# Altium schematic sheet 00_BLBB_Top.SchDoc
size A4; SheetNumber: 1; SheetTotal: 4
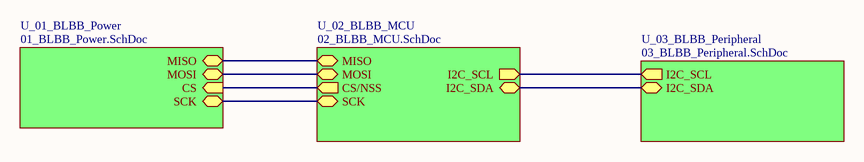
[diagram p0: 00_BLBB_Top.SchDoc]

## Sub-sheets
U_01_BLBB_Power = 01_BLBB_Power.SchDoc: MISO (bidir), SCK (bidir), CS (in), MOSI (bidir)
U_02_BLBB_MCU = 02_BLBB_MCU.SchDoc: I2C_SDA (bidir), MISO (bidir), MOSI (bidir), CS/NSS (out), SCK (bidir), I2C_SCL (out)
U_03_BLBB_Peripheral = 03_BLBB_Peripheral.SchDoc: I2C_SCL (out), I2C_SDA (bidir)

## Nets
(unnamed): sheet U_01_BLBB_Power/MISO, sheet U_02_BLBB_MCU/MISO
(unnamed): sheet U_01_BLBB_Power/SCK, sheet U_02_BLBB_MCU/SCK
(unnamed): sheet U_01_BLBB_Power/CS, sheet U_02_BLBB_MCU/CS/NSS
(unnamed): sheet U_01_BLBB_Power/MOSI, sheet U_02_BLBB_MCU/MOSI
(unnamed): sheet U_02_BLBB_MCU/I2C_SDA, sheet U_03_BLBB_Peripheral/I2C_SDA
(unnamed): sheet U_02_BLBB_MCU/I2C_SCL, sheet U_03_BLBB_Peripheral/I2C_SCL